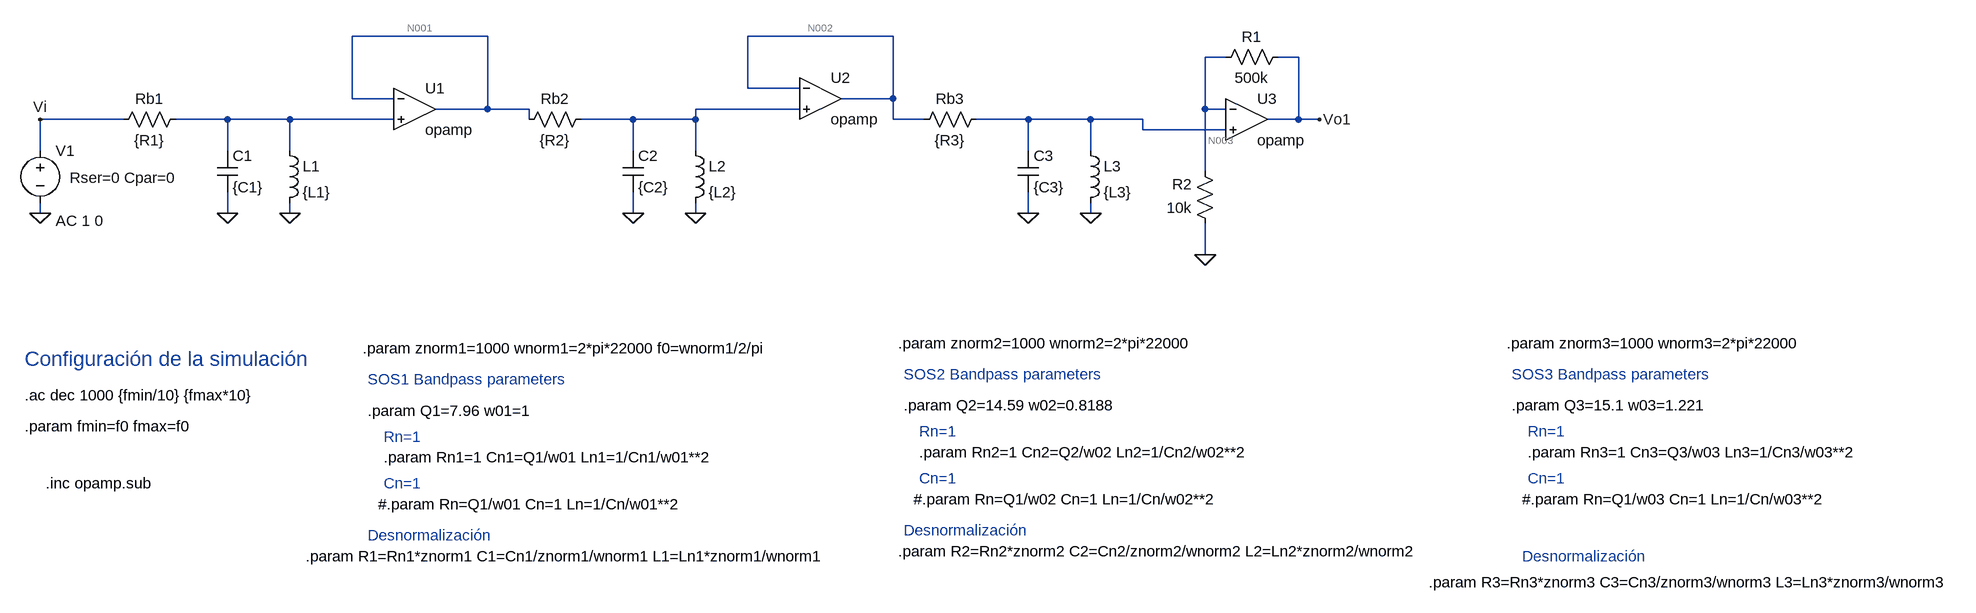
[diagram p0: schematic bandpass pasivo simple parametrizado.asc]
bandpass pasivo simple parametrizado.asc, the LTspice schematic file:
Version 4
SHEET 1 2904 856
WIRE 544 -32 336 -32
WIRE 1168 -32 944 -32
WIRE 1680 0 1648 0
WIRE 1792 0 1760 0
WIRE 944 48 944 -32
WIRE 1024 48 944 48
WIRE 336 64 336 -32
WIRE 400 64 336 64
WIRE 1168 64 1168 -32
WIRE 1168 64 1088 64
WIRE 544 80 544 -32
WIRE 544 80 464 80
WIRE 608 80 544 80
WIRE 1024 80 864 80
WIRE 1648 80 1648 0
WIRE 1680 80 1648 80
WIRE -16 96 -144 96
WIRE 144 96 64 96
WIRE 240 96 144 96
WIRE 400 96 240 96
WIRE 608 96 608 80
WIRE 768 96 688 96
WIRE 864 96 864 80
WIRE 864 96 768 96
WIRE 1168 96 1168 64
WIRE 1216 96 1168 96
WIRE 1376 96 1296 96
WIRE 1472 96 1376 96
WIRE 1552 96 1472 96
WIRE 1792 96 1792 0
WIRE 1792 96 1744 96
WIRE 1824 96 1792 96
WIRE 1552 112 1552 96
WIRE 1680 112 1552 112
WIRE -144 144 -144 96
WIRE 144 144 144 96
WIRE 240 144 240 96
WIRE 768 144 768 96
WIRE 864 144 864 96
WIRE 1376 144 1376 96
WIRE 1472 144 1472 96
WIRE 1648 176 1648 80
WIRE -144 240 -144 224
WIRE 144 240 144 208
WIRE 240 240 240 224
WIRE 768 240 768 208
WIRE 864 240 864 224
WIRE 1376 240 1376 208
WIRE 1472 240 1472 224
WIRE 1648 304 1648 256
FLAG 240 240 0
FLAG 144 240 0
FLAG -144 240 0
FLAG -144 96 Vi
FLAG 864 240 0
FLAG 768 240 0
FLAG 1472 240 0
FLAG 1376 240 0
FLAG 1824 96 Vo1
FLAG 1648 304 0
SYMBOL res 80 80 R90
WINDOW 0 0 56 VBottom 2
WINDOW 3 32 56 VTop 2
SYMATTR InstName Rb1
SYMATTR Value {R1}
SYMBOL ind 224 128 R0
SYMATTR InstName L1
SYMATTR Value {L1}
SYMBOL cap 128 144 R0
SYMATTR InstName C1
SYMATTR Value {C1}
SYMBOL voltage -144 128 R0
WINDOW 123 24 124 Left 2
WINDOW 39 45 58 Left 2
SYMATTR Value2 AC 1 0
SYMATTR SpiceLine Rser=0 Cpar=0
SYMATTR InstName V1
SYMATTR Value ""
SYMBOL res 704 80 R90
WINDOW 0 0 56 VBottom 2
WINDOW 3 32 56 VTop 2
SYMATTR InstName Rb2
SYMATTR Value {R2}
SYMBOL ind 848 128 R0
SYMATTR InstName L2
SYMATTR Value {L2}
SYMBOL cap 752 144 R0
SYMATTR InstName C2
SYMATTR Value {C2}
SYMBOL res 1312 80 R90
WINDOW 0 0 56 VBottom 2
WINDOW 3 32 56 VTop 2
SYMATTR InstName Rb3
SYMATTR Value {R3}
SYMBOL ind 1456 128 R0
SYMATTR InstName L3
SYMATTR Value {L3}
SYMBOL cap 1360 144 R0
SYMATTR InstName C3
SYMATTR Value {C3}
SYMBOL OpAmps\\opamp 432 16 R0
SYMATTR InstName U1
SYMBOL OpAmps\\opamp 1056 0 R0
SYMATTR InstName U2
SYMBOL OpAmps\\opamp 1712 32 R0
SYMATTR InstName U3
SYMBOL res 1776 -16 R90
WINDOW 0 0 56 VBottom 2
WINDOW 3 32 56 VTop 2
SYMATTR InstName R1
SYMATTR Value 500k
SYMBOL res 1664 272 R180
WINDOW 0 36 76 Left 2
WINDOW 3 36 40 Left 2
SYMATTR InstName R2
SYMATTR Value 10k
TEXT -168 520 Left 2 !.ac dec 1000 {fmin/10} {fmax*10}
TEXT 352 448 Left 2 !.param znorm1=1000 wnorm1=2*pi*22000 f0=wnorm1/2/pi
TEXT -168 464 Left 3 ;Configuración de la simulación
TEXT 360 544 Left 2 !.param Q1=7.96 w01=1
TEXT 360 496 Left 2 ;SOS1 Bandpass parameters
TEXT -168 568 Left 2 !.param fmin=f0 fmax=f0
TEXT 384 616 Left 2 !.param Rn1=1 Cn1=Q1/w01 Ln1=1/Cn1/w01**2
TEXT 264 768 Left 2 !.param R1=Rn1*znorm1 C1=Cn1/znorm1/wnorm1 L1=Ln1*znorm1/wnorm1
TEXT 376 688 Left 2 !#.param Rn=Q1/w01 Cn=1 Ln=1/Cn/w01**2
TEXT 384 584 Left 2 ;Rn=1
TEXT 384 656 Left 2 ;Cn=1
TEXT 360 736 Left 2 ;Desnormalización
TEXT 1176 440 Left 2 !.param znorm2=1000 wnorm2=2*pi*22000
TEXT 1184 536 Left 2 !.param Q2=14.59 w02=0.8188
TEXT 1184 488 Left 2 ;SOS2 Bandpass parameters
TEXT 1208 608 Left 2 !.param Rn2=1 Cn2=Q2/w02 Ln2=1/Cn2/w02**2
TEXT 1176 760 Left 2 !.param R2=Rn2*znorm2 C2=Cn2/znorm2/wnorm2 L2=Ln2*znorm2/wnorm2
TEXT 1200 680 Left 2 !#.param Rn=Q1/w02 Cn=1 Ln=1/Cn/w02**2
TEXT 1208 576 Left 2 ;Rn=1
TEXT 1208 648 Left 2 ;Cn=1
TEXT 1184 728 Left 2 ;Desnormalización
TEXT 2112 440 Left 2 !.param znorm3=1000 wnorm3=2*pi*22000
TEXT 2120 536 Left 2 !.param Q3=15.1 w03=1.221
TEXT 2120 488 Left 2 ;SOS3 Bandpass parameters
TEXT 2144 608 Left 2 !.param Rn3=1 Cn3=Q3/w03 Ln3=1/Cn3/w03**2
TEXT 1992 808 Left 2 !.param R3=Rn3*znorm3 C3=Cn3/znorm3/wnorm3 L3=Ln3*znorm3/wnorm3
TEXT 2136 680 Left 2 !#.param Rn=Q1/w03 Cn=1 Ln=1/Cn/w03**2
TEXT 2144 576 Left 2 ;Rn=1
TEXT 2144 648 Left 2 ;Cn=1
TEXT 2136 768 Left 2 ;Desnormalización
TEXT -136 656 Left 2 !.inc opamp.sub

The netlist it stands for:
* bandpass pasivo simple parametrizado.asc
Rb1 N005 Vi {R1}
L1 N005 0 {L1}
C1 N005 0 {C1}
V1 Vi 0 AC 1 0 Rser=0 Cpar=0
Rb2 N004 N001 {R2}
L2 N004 0 {L2}
C2 N004 0 {C2}
Rb3 N006 N002 {R3}
L3 N006 0 {L3}
C3 N006 0 {C3}
XU1 N001 N005 N001 opamp Aol=100K GBW=10Meg  ; pins invin noninvin out
XU2 N002 N004 N002 opamp Aol=100K GBW=10Meg  ; pins invin noninvin out
XU3 N003 N006 Vo1 opamp Aol=100K GBW=10Meg  ; pins invin noninvin out
R1 Vo1 N003 500k
R2 0 N003 10k
.ac dec 1000 {fmin/10} {fmax*10}
.param znorm1=1000 wnorm1=2*pi*22000 f0=wnorm1/2/pi
* Configuración de la simulación
.param Q1=7.96 w01=1
* SOS1 Bandpass parameters
.param fmin=f0 fmax=f0
.param Rn1=1 Cn1=Q1/w01 Ln1=1/Cn1/w01**2
.param R1=Rn1*znorm1 C1=Cn1/znorm1/wnorm1 L1=Ln1*znorm1/wnorm1
#.param Rn=Q1/w01 Cn=1 Ln=1/Cn/w01**2
* Rn=1
* Cn=1
* Desnormalización
.param znorm2=1000 wnorm2=2*pi*22000
.param Q2=14.59 w02=0.8188
* SOS2 Bandpass parameters
.param Rn2=1 Cn2=Q2/w02 Ln2=1/Cn2/w02**2
.param R2=Rn2*znorm2 C2=Cn2/znorm2/wnorm2 L2=Ln2*znorm2/wnorm2
#.param Rn=Q1/w02 Cn=1 Ln=1/Cn/w02**2
* Rn=1
* Cn=1
* Desnormalización
.param znorm3=1000 wnorm3=2*pi*22000
.param Q3=15.1 w03=1.221
* SOS3 Bandpass parameters
.param Rn3=1 Cn3=Q3/w03 Ln3=1/Cn3/w03**2
.param R3=Rn3*znorm3 C3=Cn3/znorm3/wnorm3 L3=Ln3*znorm3/wnorm3
#.param Rn=Q1/w03 Cn=1 Ln=1/Cn/w03**2
* Rn=1
* Cn=1
* Desnormalización
.inc opamp.sub
.backanno
.end

* Results of the author's LTspice run, read from the files saved beside the schematic
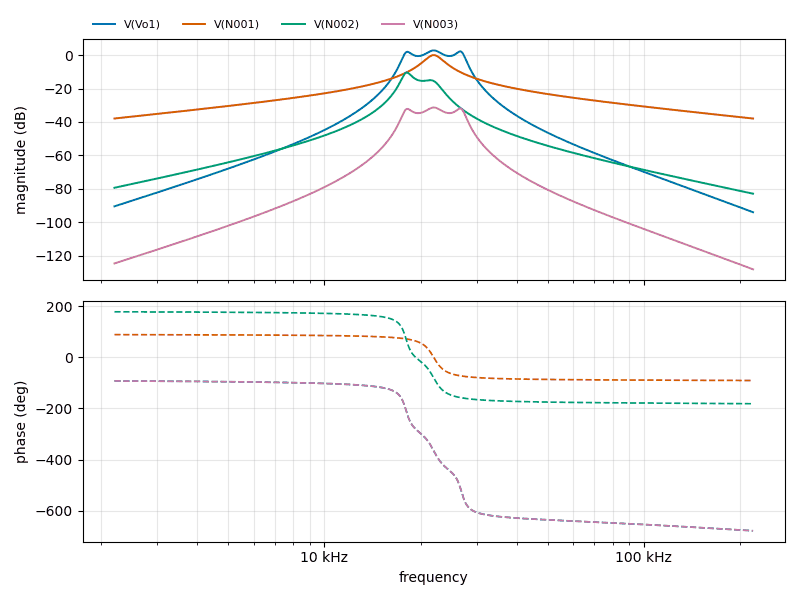
[diagram p1: AC Analysis of bandpass pasivo simple parametrizado.asc, plotted from the saved traces]
* AC Analysis, 1 run:
*   V(Vo1): -90.46 dB at 2.2 kHz, -94.00 dB at 220 kHz, peak 2.81 dB at 22 kHz, 3 dB below the peak at 20.2 kHz and 23.98 kHz
*   V(N001): -37.93 dB at 2.2 kHz, -37.93 dB at 220 kHz, peak -0.00 dB at 22 kHz, 3 dB below the peak at 20.66 kHz and 23.43 kHz
*   V(N002): -79.35 dB at 2.2 kHz, -82.90 dB at 220 kHz, peak -10.41 dB at 18.13 kHz, 3 dB below the peak at 17.56 kHz and 18.99 kHz
*   V(N003): -124.61 dB at 2.2 kHz, -128.15 dB at 220 kHz, peak -31.34 dB at 22 kHz, 3 dB below the peak at 20.2 kHz and 23.98 kHz